# EAGLE design pcb2 (EAGLE 9.7.0)
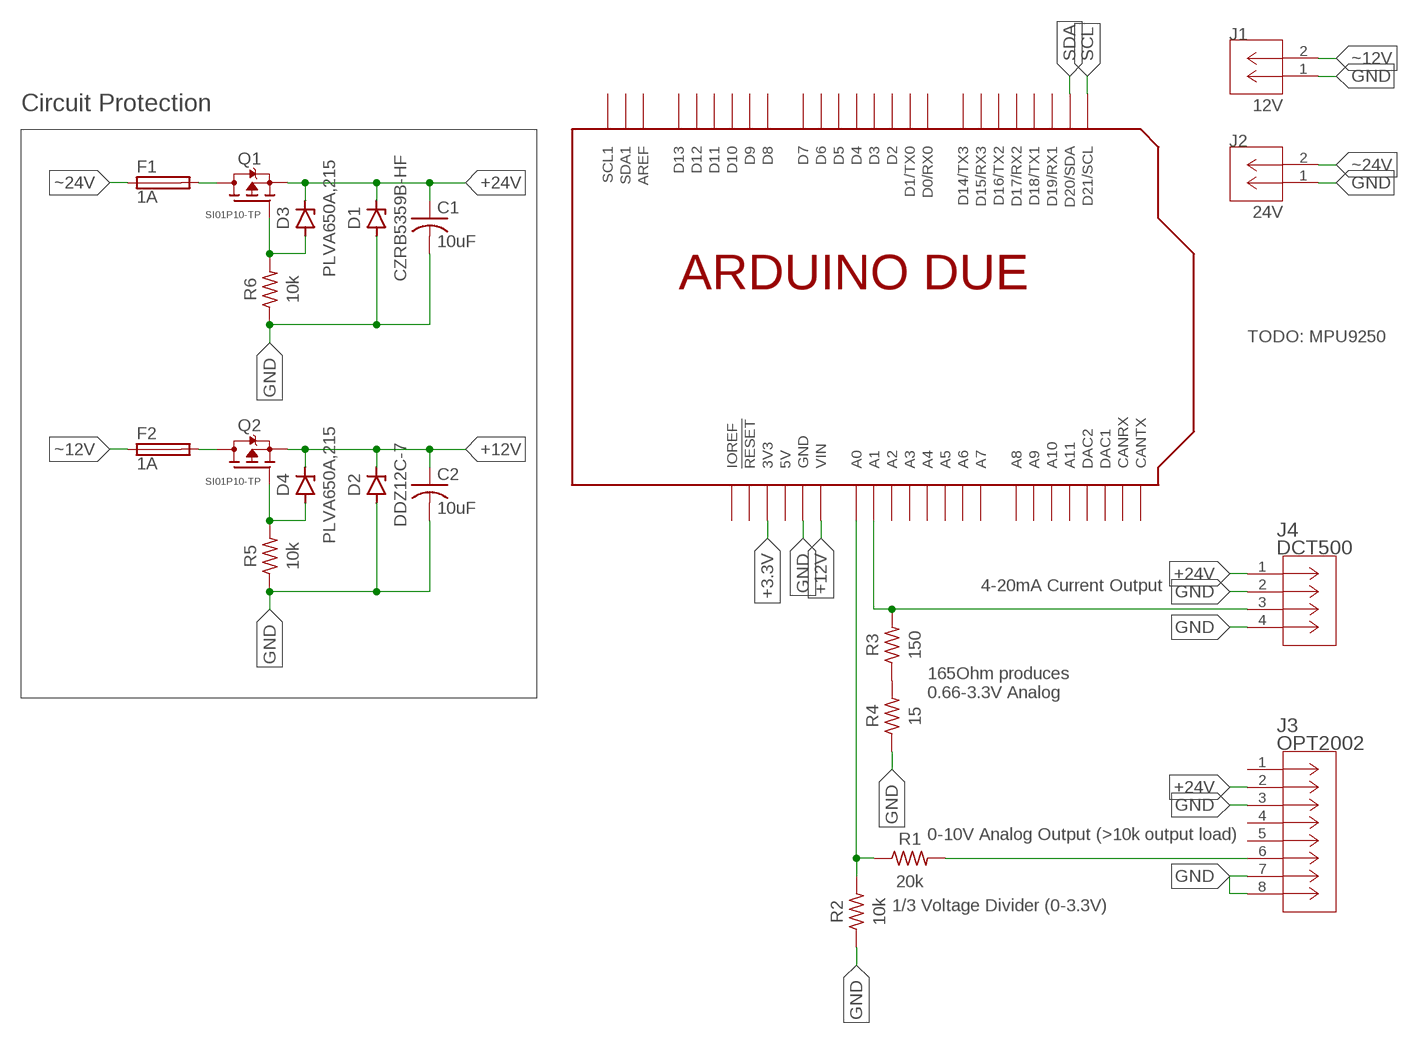
[diagram p0: schematic, sheet 1]

## Parts
C1  10uF  C-US_CHIP-1206(3216-METRIC)  [CAPC3216X135]
C2  10uF  C-US_CHIP-1206(3216-METRIC)  [CAPC3216X135]
D1  CZRB5359B-HF  ZENER_SMBJ5339BDO-214AA(SMB)  [DIOM5336X265N]
D2  DDZ12C-7  ZENER_MMSZ5240BTDO-219-AB(SOD123F)  [SODFL3718X115]
D3  PLVA650A,215  ZENER_SOT23  [SOT23]
D4  PLVA650A,215  ZENER_SOT23  [SOT23]
F1  1A  FUSE_CHIP-0603(1608-METRIC)  [FUSC1608X60N]
F2  1A  FUSE_CHIP-0603(1608-METRIC)  [FUSC1608X60N]
J1  12V  MICROLOCK-2PINCON_5055670271  [2PIN]
J2  24V  MICROLOCK-2PINCON_5055670271  [2PIN]
J3  OPT2002  MICROLOCK-8PIN  [8PIN]
J4  DCT500  MICROLOCK-4PIN  [4PIN]
Q1  SI01P10-TP  PMOSFET_SOT23  [SOT23]
Q2  SI01P10-TP  PMOSFET_SOT23  [SOT23]
R1  20k  R-US_CHIP-0603(1608-METRIC)  [RESC1608X60]
R2  10k  R-US_CHIP-0603(1608-METRIC)  [RESC1608X60]
R3  150  R-US_CHIP-0603(1608-METRIC)  [RESC1608X60]
R4  15  R-US_CHIP-0603(1608-METRIC)  [RESC1608X60]
R5  10k  R-US_CHIP-0603(1608-METRIC)  [RESC1608X60]
R6  10k  R-US_CHIP-0603(1608-METRIC)  [RESC1608X60]
U$1  ARDUINODUE_MIN_NOHOLES  [ARDUINODUE_MIN_NOHOLES]

## Nets
+3.3V: U$1.3V3
+12V: C2.1 D2.1(C) D4.3(C) Q2.2(S) U$1.VIN
+24V: C1.1 D1.1(C) D3.3(C) J3.2 J4.1 Q1.2(S)
GND: C1.2 C2.2 D1.2(A) D2.2(A) J1.1 J2.1 J3.3 J3.7 J3.8 J4.2 J4.4 R2.1 R4.1 R5.1 R6.1 U$1.GND U$1.GND1(GND) U$1.GND2(GND)
N$1: J3.6 R1.2
N$2: R1.1 R2.2 U$1.A0
N$3: J4.3 R3.2 U$1.A1
N$4: R3.1 R4.2
N$9: D3.1(A) Q1.1(G) R6.2
N$11: D4.1(A) Q2.1(G) R5.2
N$12: F2.2 Q2.3(D)
N$13: F1.2 Q1.3(D)
SCL: U$1.D21(D21/SCL)
SDA: U$1.D20(D20/SDA)
~12V: F2.1 J1.2
~24V: F1.1 J2.2
Unconnected: J3.1 J3.4 J3.5 U$1.A2 U$1.A3 U$1.A4 U$1.A5 U$1.A6 U$1.A7 U$1.A8 U$1.A9 U$1.A10 U$1.A11 U$1.AREF U$1.CANRX U$1.CANTX U$1.D0(D0/RX0) U$1.D1(D1/TX0) U$1.D2 U$1.D3 U$1.D4 U$1.D5 U$1.D6 U$1.D7 U$1.D8 U$1.D9 U$1.D10 U$1.D11 U$1.D12 U$1.D13 U$1.D14(D14/TX3) U$1.D15(D15/RX3) U$1.D16(D16/TX2) U$1.D17(D17/RX2) U$1.D18(D18/TX1) U$1.D19(D19/RX1) U$1.DAC1 U$1.DAC2 U$1.IOREF U$1.RESET(!RESET) U$1.SCL1 U$1.SDA1

## Notes on the sheet
- Circuit Protection
- TODO: MPU9250
- 4-20mA Current Output
- 165Ohm produces
  0.66-3.3V Analog
- 0-10V Analog Output (>10k output load)
- 1/3 Voltage Divider (0-3.3V)

## Power pins joined to a net without a drawn wire
5V: U$1.5V

## Library data of the parts
C1 C2 = Capacitor:C-US: Capacitor - ANSI; CATEGORY: Capacitor
D1 = Diode:ZENER_: Zener Diode - Popular parts; CATEGORY: Diode; DESCRIPTION: DIODE ZENER 5.6V 5W DO214AA; MANUFACTURER: Micro Commercial Co; MPN: SMBJ5339B-TP; SUB-CATEGORY: Zener; THERMALLOSS: 5W; VALUE: SMBJ5339B
D2 = Diode:ZENER_: Zener Diode - Popular parts; CATEGORY: Diode; DESCRIPTION: DIODE ZENER 10V 500MW SOD123; MANUFACTURER: ON Semiconductor; MPN: MMSZ5240BT1G; SUB-CATEGORY: Zener; THERMALLOSS: 0.5W; VALUE: MMSZ5240BT1G
D3 D4 = Zener SOT23:ZENER_SOT23
F1 F2 = Circuit-Protection:FUSE: Fuse - Generic; CATEGORY: Circuit-Protection; SUB-CATEGORY: Fuse
J1 J2 = Molex Micro-Lock PLUS:MICROLOCK-2PIN; COPYRIGHT: Copyright (C) 2022 Ultra Librarian. All rights reserved.; MANUFACTURER_PART_NUMBER: 5055670271; MFR_NAME: Molex Connector Corporation
J3 = Molex Micro-Lock PLUS:MICROLOCK-8PIN
J4 = Molex Micro-Lock PLUS:MICROLOCK-4PIN
Q1 Q2 = MOSFET SOT23:PMOSFET_SOT23
R1-R6 = Resistor:R-US: Resistor Fixed - ANSI; CATEGORY: Resistor; SUB-CATEGORY: Fixed
U$1 = Arduino Shields:ARDUINODUE_MIN_NOHOLES

## Board
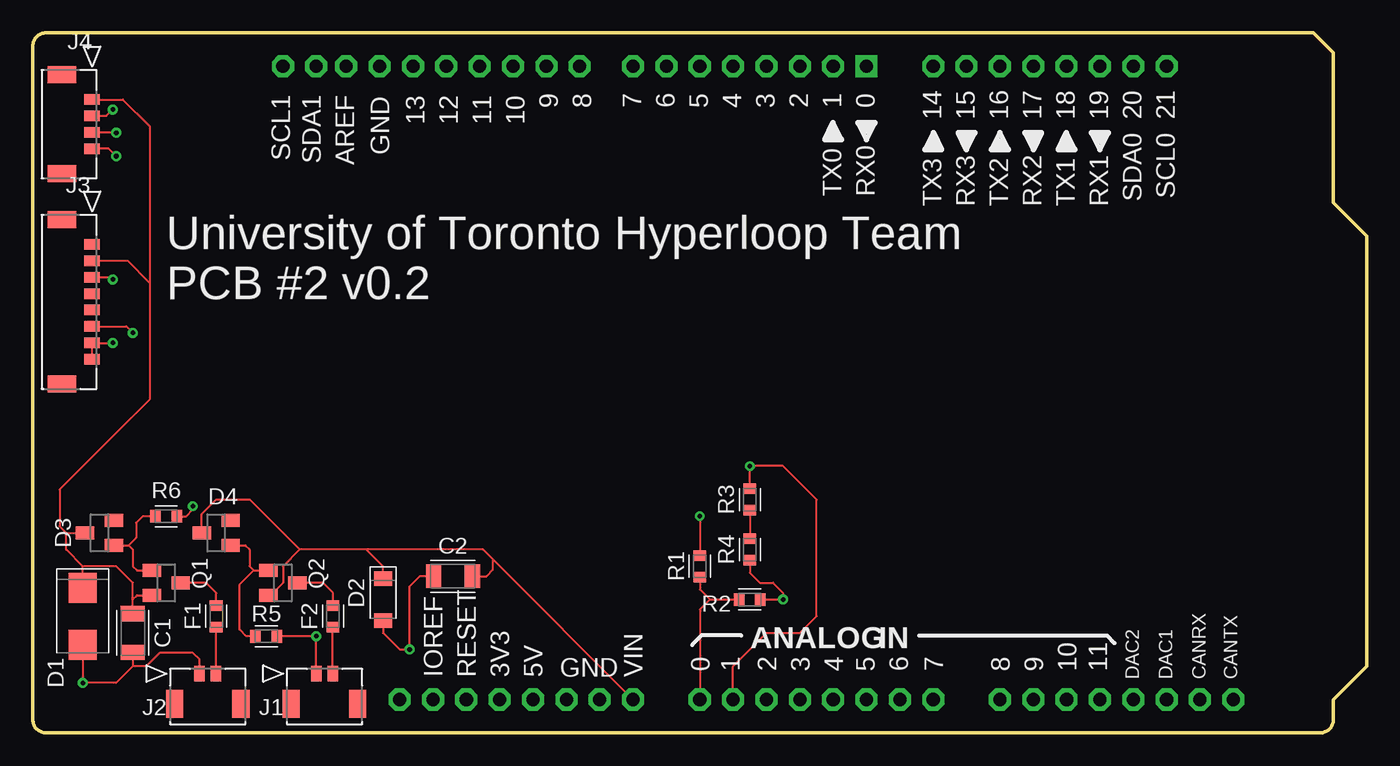
[diagram p1: board, top side]
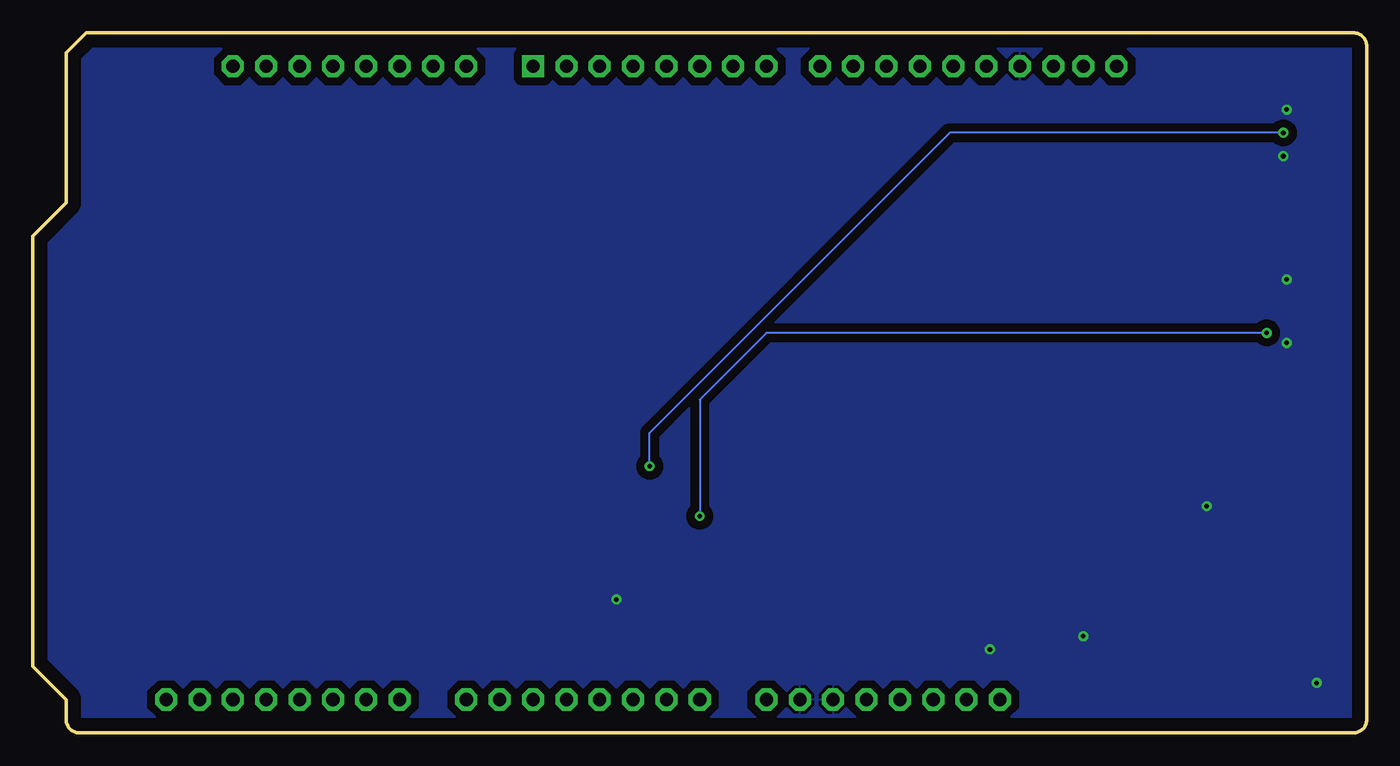
[diagram p2: board, bottom side, seen from below]

Size 101.6 x 53.34 mm. Coordinates in mm from the lower left corner, seen from the top.
Copper layers (1*16): Top 0.035mm / dielectric 1.5mm / Bottom 0.035mm
Design rules "default": minimum track width 6mil, minimum drill 0.35mm, track to track 6mil, track to pad 6mil, pad to pad 6mil, via to via 6mil, smd to smd 6mil, copper to edge 40mil, drill to drill 6mil, minimum pad ring 10mil, minimum via ring 8mil, stop-mask expansion 4mil, vias tented up to drill 0mil, thermal gap 10mil

### Footprints (pad centres in the part's own frame; a part is rotated, then mirrored left to right if it is on the bottom)
CAPC3216X135 = smd 1.165 x 1.815: 1 -1.475,0; 2 1.475,0
DIOM5336X265N = smd 2.284 x 2.124: 1 -2.164,0; 2 2.164,0
SODFL3718X115 = smd 1.115 x 1.361: 1 -1.6,0; 2 1.6,0
SOT23 = smd 1 x 1.4: 1 -0.95,-1.1; 2 0.95,-1.1; 3 0,1.1
FUSC1608X60N = smd 0.799 x 0.974: 1 -0.815,0; 2 0.815,0
2PIN = smd 0.8 x 1.2: 1 0,0; 2 -1.25,0 | smd 1.3 x 2.15: 3 1.9,2.295; 4 -3.15,2.295
8PIN = smd 0.8 x 1.2: 1 0,0; 2 -1.25,0; 3 -2.5,0; 4 -3.75,0; 5 -5,0; 6 -6.25,0; 7 -7.5,0; 8 -8.75,0 | smd 1.3 x 2.15: 9 1.9,2.295; 10 -10.65,2.295
4PIN = smd 0.8 x 1.2: 1 0,0; 2 -1.25,0; 3 -2.5,0; 4 -3.75,0 | smd 1.3 x 2.15: 5 1.9,2.295; 6 -5.65,2.295
RESC1608X60 = smd 0.799 x 0.974: 1 -0.815,0; 2 0.815,0
ARDUINODUE_MIN_NOHOLES = drill 1 pad 1.676 octagon: 3V3 35.56,2.54; 5V 38.1,2.54; A0 50.8,2.54; A1 53.34,2.54; A2 55.88,2.54; A3 58.42,2.54; A4 60.96,2.54; A5 63.5,2.54; A6 66.04,2.54; A7 68.58,2.54; A8 73.66,2.54; A9 76.2,2.54; A10 78.74,2.54; A11 81.28,2.54; AREF 23.876,50.8; CANRX 88.9,2.54; CANTX 91.44,2.54; D1 60.96,50.8; D2 58.42,50.8; D3 55.88,50.8; D4 53.34,50.8; D5 50.8,50.8; D6 48.26,50.8; D7 45.72,50.8; D8 41.656,50.8; D9 39.116,50.8; D10 36.576,50.8; D11 34.036,50.8; D12 31.496,50.8; D13 28.956,50.8; D14 68.58,50.8; D15 71.12,50.8; D16 73.66,50.8; D17 76.2,50.8; D18 78.74,50.8; D19 81.28,50.8; D20 83.82,50.8; D21 86.36,50.8; DAC1 86.36,2.54; DAC2 83.82,2.54; GND 26.416,50.8; GND1 43.18,2.54; GND2 40.64,2.54; IOREF 30.48,2.54; NC 27.94,2.54; RESET 33.02,2.54; SCL1 19.05,50.8; SDA1 21.59,50.8; VIN 45.72,2.54 | drill 1 pad 1.676 square: D0 63.5,50.8

### Placement (x,y rotation side)
C1  7.62,7.62 270 top
C2  32,11.94 180 top
D1  3.81,8.89 270 top
D2  26.67,10.16 270 top
D3  5.08,15.24 90 top
D4  13.97,15.24 90 top
F1  13.97,8.89 90 top
F2  22.86,8.89 90 top
J1  21.59,4.51 180 top
J2  12.7,4.51 180 top
J3  4.51,37.22 90 top
J4  4.51,48.26 90 top
Q1  10.16,11.43 270 top
Q2  19.05,11.43 270 top
R1  50.8,12.7 90 top
R2  54.61,10.16 180 top
R3  54.61,17.78 90 top
R4  54.61,13.97 90 top
R5  17.78,7.37 180 top
R6  10.16,16.51 180 top
U$1  0,0 0 top

### Tracks (layer width: path | path; a pad name or v marks a point on that pad's centre or on a via)
+12V
  Top 0.152: Q2.2 18.1,10.48 19.05,11.43 19.05,12.7 20.32,13.97 | U$1.VIN 35.05,13.21 | 35.05,13.21 34.29,13.97 25.4,13.97 | 25.4,13.97 20.32,13.97 | D4.3 12.87,16.68 13.97,17.78 16.51,17.78 20.32,13.97 | D2.1 26.67,12.7 25.4,13.97 | C2.1 34.54,11.94 35.05,12.45 35.05,13.21
+24V
  Top 0.152: 8.89,34.29 8.89,46.23 6.86,48.26 J4.1 | 8.89,34.29 8.89,25.4 2.03,18.54 2.03,15.75 2.54,15.24 | 2.54,15.24 D3.3 | J3.2 7.21,35.97 8.89,34.29 | C1.1 7.62,10.16 | 7.62,10.16 7.94,10.48 Q1.2 | D1.1 3.81,12.7 | 3.81,12.7 2.54,13.97 2.54,15.24 | 7.62,10.16 7.62,11.43 6.35,12.7 3.81,12.7
GND  (via drill 0.35)
  Top 0.152: D1.2 v3.81,3.81 6.35,3.81 7.62,5.08 | R5.1 v21.59,7.37 J1.1 | R6.1 11.68,16.51 12.19,17.02 v12.19,17.27 | D2.2 26.67,7.62 27.94,6.35 v28.7,6.35 28.7,11.18 29.46,11.94 C2.2 | J2.1 12.7,5.59 12.19,6.1 9.65,6.1 8.64,5.08 7.62,5.08 | J4.2 5.61,47.01 v6.1,47.5 | J4.4 5.78,44.51 v6.35,43.94 | J3.3 5.92,34.72 v6.1,34.54 | J3.8 J3.7 v6.09,29.72 v6.1,29.72 | R2.1 v57.15,10.16 57.15,10.67 56.39,11.43 55.37,11.43 54.61,12.19 R4.1 | C1.2 7.62,5.08
  pour Bottom (isolate 0.635): -1.27,54.61 102.87,54.61 102.87,-1.27 -1.27,-1.27
N$1  (via drill 0.35)
  Top 0.152: J3.6 7.13,30.97 v7.62,30.48 | v50.8,16.51 R1.2
  Bottom 0.152: v7.62,30.48 45.72,30.48 50.8,25.4 v50.8,16.51
N$2
  Top 0.152: R1.1 50.8,10.92 51.56,10.16 | 51.56,10.16 R2.2 | 51.56,10.16 50.8,9.4 U$1.A0
N$3  (via drill 0.35)
  Top 0.152: J4.3 6.31,45.76 v6.35,45.72 | R3.2 v54.61,20.32 57.15,20.32 59.69,17.78 59.69,8.89 58.42,7.62 55.88,7.62 53.34,5.08 U$1.A1
  Bottom 0.152: v6.35,45.72 31.75,45.72 54.61,22.86 v54.61,20.32
N$4
  Top 0.152: R3.1 R4.2
N$9
  Top 0.152: D3.1 7.3,14.29 | 7.3,14.29 7.62,13.97 7.62,12.7 7.94,12.38 Q1.1 | R6.2 8.38,16.51 7.87,16 7.87,14.86 7.3,14.29
N$11
  Top 0.152: D4.1 16.19,14.29 16.51,13.97 16.51,12.7 16.83,12.38 | 16.83,12.38 Q2.1 | R5.2 16.26,7.37 15.75,7.87 15.75,11.3 16.83,12.38
N$12
  Top 0.152: F2.2 22.86,10.67 22.1,11.43 Q2.3
N$13
  Top 0.152: F1.2 13.97,10.67 13.21,11.43 Q1.3
~12V
  Top 0.152: F2.1 22.84,8.05 J1.2
~24V
  Top 0.152: J2.2 13.95,8.05 F1.1

### Text on the board
tPlace: University of Toronto Hyperloop Team / PCB #2 v0.2